# EAGLE design wireless-dong-mk-2.2 (EAGLE 6.5.0)
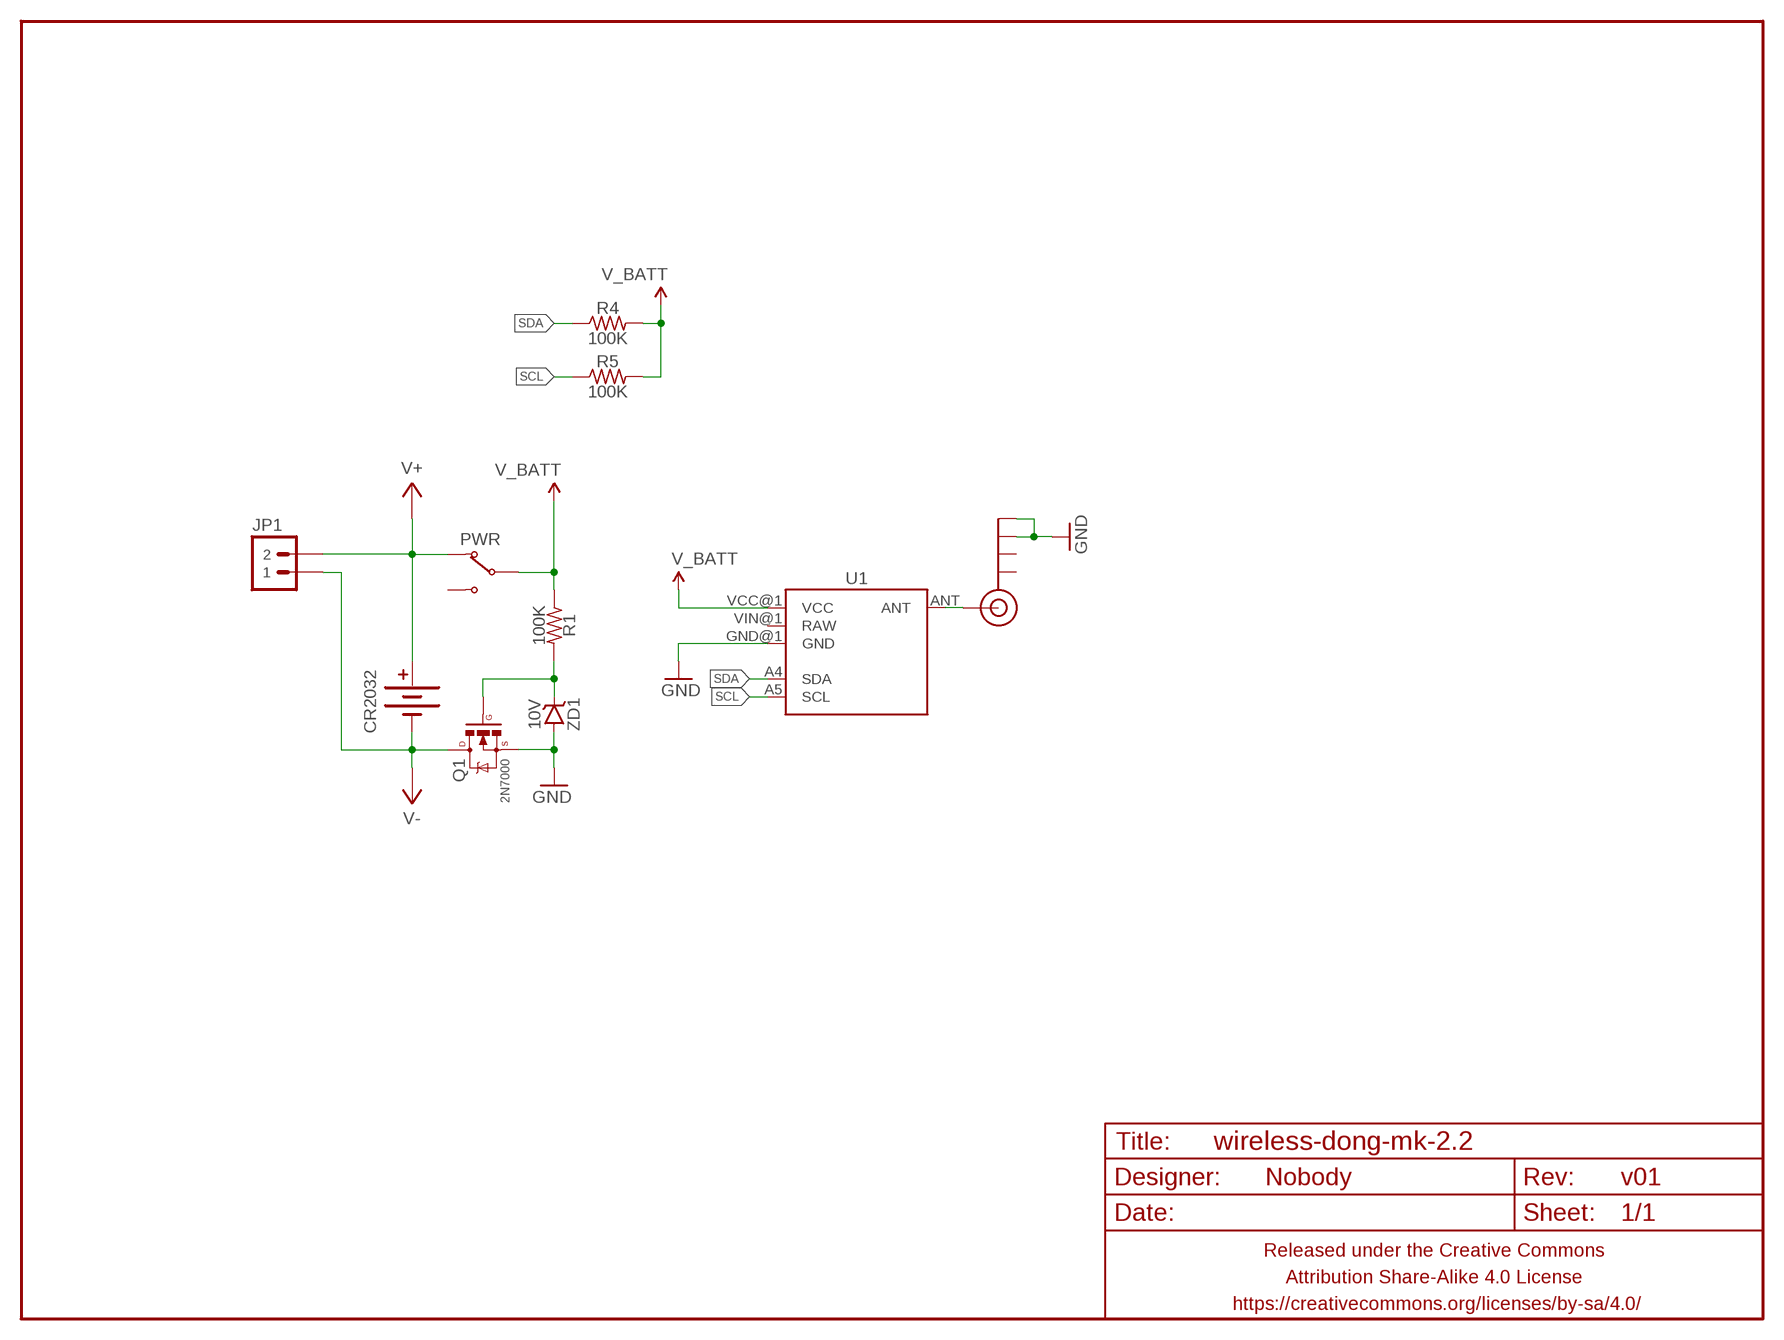
[diagram p0: schematic, sheet 1]

## Parts
ANT  SMA_EDGE  [SMA-EDGE]
CR2032  BATTERY20PTH_TOPLOAD  [BATTCON_20MM_PTH_TOPLOAD]
FRAME1  FRAME-LETTERNO_PACKAGE  [DUMMY]
JP1  M02PTH-CENTERED-R+  [1X02-CENTER-R+]
PWR  SWITCH-SPDTPTH-RA-2.54MM  [SPDT-RA-2.54MM]
Q1  2N7000  MOSFET-NCHANNEL2N7000-AMMO  [TO-92-AMMO]
R1  100K  RESISTORPTH-AXIAL-7.62MM  [RESISTOR-AXIAL-PTH-7.62MM]
R4  100K  RESISTORPTH-AXIAL-7.62MM  [RESISTOR-AXIAL-PTH-7.62MM]
R5  100K  RESISTORPTH-AXIAL-7.62MM  [RESISTOR-AXIAL-PTH-7.62MM]
U1  MOTEINO_BOAT  [MOTEINO_BOAT]
ZD1  10V  DIODE-ZENER7.62MM-PTH  [DIODE-ZENNER-7.62MM]

## Nets
GND: ANT.GND@2(GND) ANT.GND@3(GND) Q1.1(S) U1.GND@1(GND) ZD1.A
N$1: Q1.2(G) R1.P$2 ZD1.K(C)
N$2: ANT.SIG(SIGNAL) U1.ANT
SCL: R5.P$1 U1.A5(SCL)
SDA: R4.P$1 U1.A4(SDA)
V+: CR2032.+ JP1.2 PWR.1(NC)
V-: CR2032.- JP1.1 Q1.3(D)
V_BATT: PWR.2(COM) R1.P$1 R4.P$2 R5.P$2 U1.VCC@1(VCC)
Unconnected: ANT.GND@0(GND) ANT.GND@1(GND) PWR.3(NO) U1.VIN@1(RAW)

## Library data of the parts
ANT = A_butts:SMA_EDGE: SMA Antenna Connector End launch SMA connector. The paste layer has been removed so that the connector can be hand soldered onto the board after reflow.
CR2032 = A_butts:BATTERY: Battery Holders Various common sizes : AA, AAA, 20mm coin cell and 12mm coin cell. 20MM_4LEGS, BATT-10373
FRAME1 = A_butts:FRAME-LETTER: Schematic Frame Standard 8.5x11 US Letter frame; DESIGNER: Nobody; VERSION: v01
JP1 = A_butts:M02: Standard 2-pin 0.1" header. Use with - straight break away headers ( PRT-00116) - right angle break away headers (PRT-00553) - swiss pins (PRT-00743) - machine pins (PRT-00117) - female headers (PRT-00115) Molex polarized connector foot print use with: PRT-08233 with associated crimp pins and housings. 2.54_SCREWTERM for use with PRT-10571. 3.5mm Screw Terminal footprints for PRT-08084 5mm Screw Terminal footprints for use with PRT-08433
PWR = A_butts:SWITCH-SPDT
Q1 = A_butts:MOSFET-NCHANNEL: Common NMOSFET Parts MFG P/N Store ID Prod ID FDD8780 TRANS-09984 SI7820DN TRANS-11055 FDS6630A IC-08089 2N7002PW TRANS-11151 FQP30N06L COM-10213 TRANS-10060 BSS123LT1G TRANS-08345 BSS138 TRANS-00830 BS170 2N7000
R1 R4 R5 = A_butts:RESISTOR: RESISTOR, American symbol
U1 = A_butts:MOTEINO_BOAT
ZD1 = A_butts:DIODE-ZENER: Zener Diode Production Part - 8199 3.4V Zener Voltage

## Board
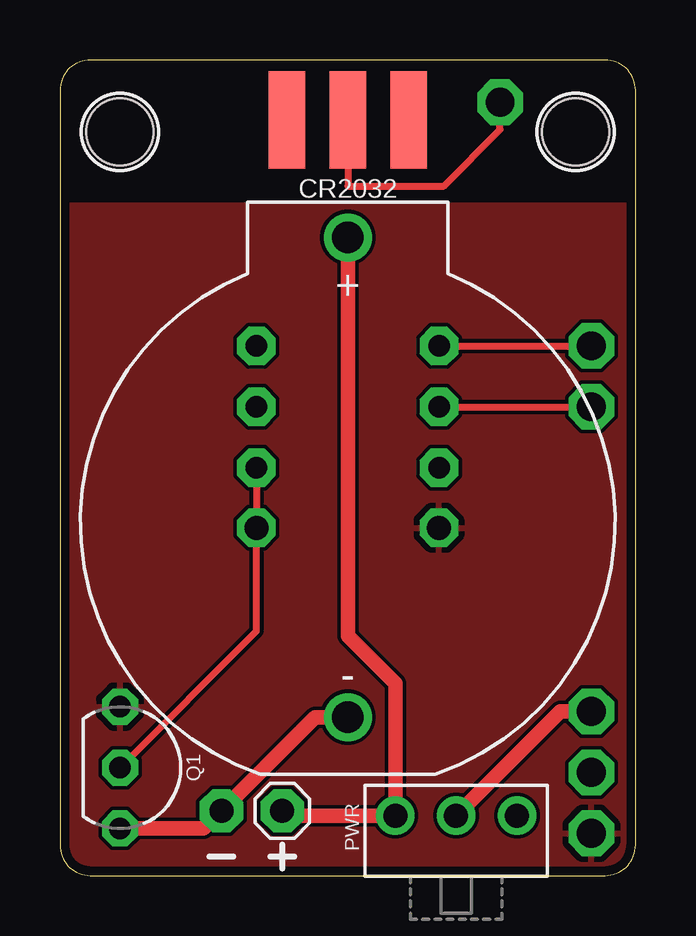
[diagram p1: board, top side]
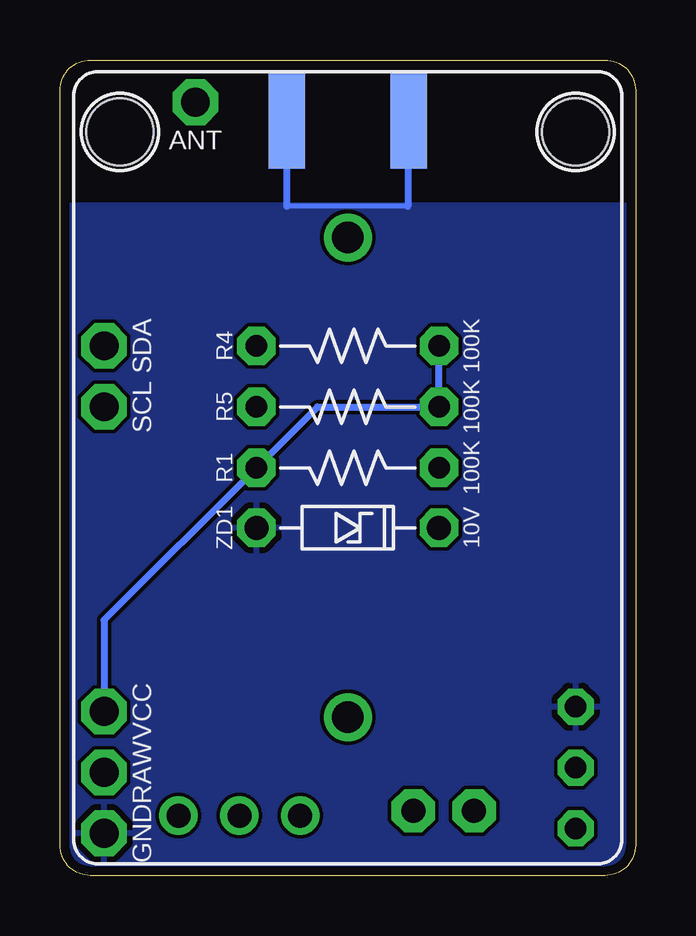
[diagram p2: board, bottom side, seen from below]

Size 24 x 34 mm. Coordinates in mm from the lower left corner, seen from the top.
Outline: 22.73,34 1.27,34 arc90 0,32.73 0,1.27 arc90 1.27,0 22.73,0 arc90 24,1.27 24,32.73 arc90 22.73,34
Copper layers (1*16): Top 0.0356mm / dielectric 1.5011mm / Bottom 0.0356mm
Design rules "LaenPCBOrder_2": minimum track width 6mil, minimum drill 13mil, track to track 6mil, track to pad 6mil, pad to pad 6mil, via to via 6mil, smd to smd 6mil, copper to edge 15mil, drill to drill 6mil, minimum pad ring 7mil, minimum via ring 7mil, stop-mask expansion 3mil, vias tented up to drill 20mil, thermal gap 10mil
Holes 2.8 mm at 21.5,31 2.5,31

### Footprints (pad centres in the part's own frame; a part is rotated, then mirrored left to right if it is on the bottom)
SMA-EDGE = smd 1.524 x 4.064: GND@0 -2.54,0; GND@1 2.54,0; SIG 0,0 | smd 1.524 x 4.064 bottom: GND@2 -2.54,0; GND@3 2.54,0
BATTCON_20MM_PTH_TOPLOAD = drill 1.3 pad 2: + 11.85,0; - -8.15,0
1X02-CENTER-R+ = drill 1 pad 1.8 octagon: 1 -1.27,0; 2 1.27,0
SPDT-RA-2.54MM = drill 1 pad 1.6: 1 0,0; 2 2.54,0; 3 5.08,0
TO-92-AMMO = drill 0.9 pad 1.5 octagon: 1 -2.54,0; 2 0,0; 3 2.54,0
RESISTOR-AXIAL-PTH-7.62MM = drill 0.9 pad 1.6 octagon: P$1 -3.81,0; P$2 3.81,0
MOTEINO_BOAT = drill 1.2 pad 1.9 octagon: A4 10.16,-5.08; A5 10.16,-2.54; ANT 6.35,-15.24; GND@1 10.16,15.24; VCC@1 10.16,10.16; VIN@1 10.16,12.7
DIODE-ZENNER-7.62MM = drill 1 pad 1.6 octagon: A -3.81,0; K 3.81,0

### Placement (x,y rotation side)
ANT  12,31.5 0 top
CR2032  12,14.75 90 top
FRAME1  0,0 0 top
JP1  8,2.7 0 top
PWR  13.98,2.5 0 top
Q1  2.5,4.5 270 top
R1  12,17 0 bottom
R4  12,22.08 0 bottom
R5  12,19.54 0 bottom
U1  12,17 180 bottom
ZD1  12,14.5 0 bottom

### Tracks (layer width: path | path; a pad name or v marks a point on that pad's centre or on a via)
GND
  Bottom 0.2: 9.5,27.9 14.54,27.9
  Bottom 0.3: ANT.GND@2 9.5,31.5 9.5,27.9 | 14.54,27.9 ANT.GND@3
  pour Top: -0.1,-0.1 -0.1,28 24.1,28 24.1,-0.1
  pour Bottom: -0.1,-0.1 -0.1,28 24.1,28 24.1,-0.1
N$1
  Top 0.3: R1.P$2 ZD1.K 8.19,10.19 Q1.2
N$2
  Top 0.3: ANT.SIG 12,28.75 16,28.75 18.35,31.1 U1.ANT
SCL
  Top 0.3: R5.P$1 U1.A5
SDA
  Top 0.3: R4.P$1 U1.A4
V+
  Top 0.6: CR2032.+ 12,10 13.98,8.02 PWR.1 9.47,2.5 JP1.2
V-
  Top 0.6: Q1.3 5.99,1.96 JP1.1 10.63,6.6 CR2032.-
V_BATT
  Top 0.6: U1.VCC@1 20.86,6.84 PWR.2
  Bottom 0.3: U1.VCC@1 22.16,10.65 R1.P$1 13.27,19.54 R5.P$2 R4.P$2